# Altium schematic sheet esp32-wroom-32.SchDoc
size 355 x 241 mm; SheetNumber: 3; SheetTotal: 3
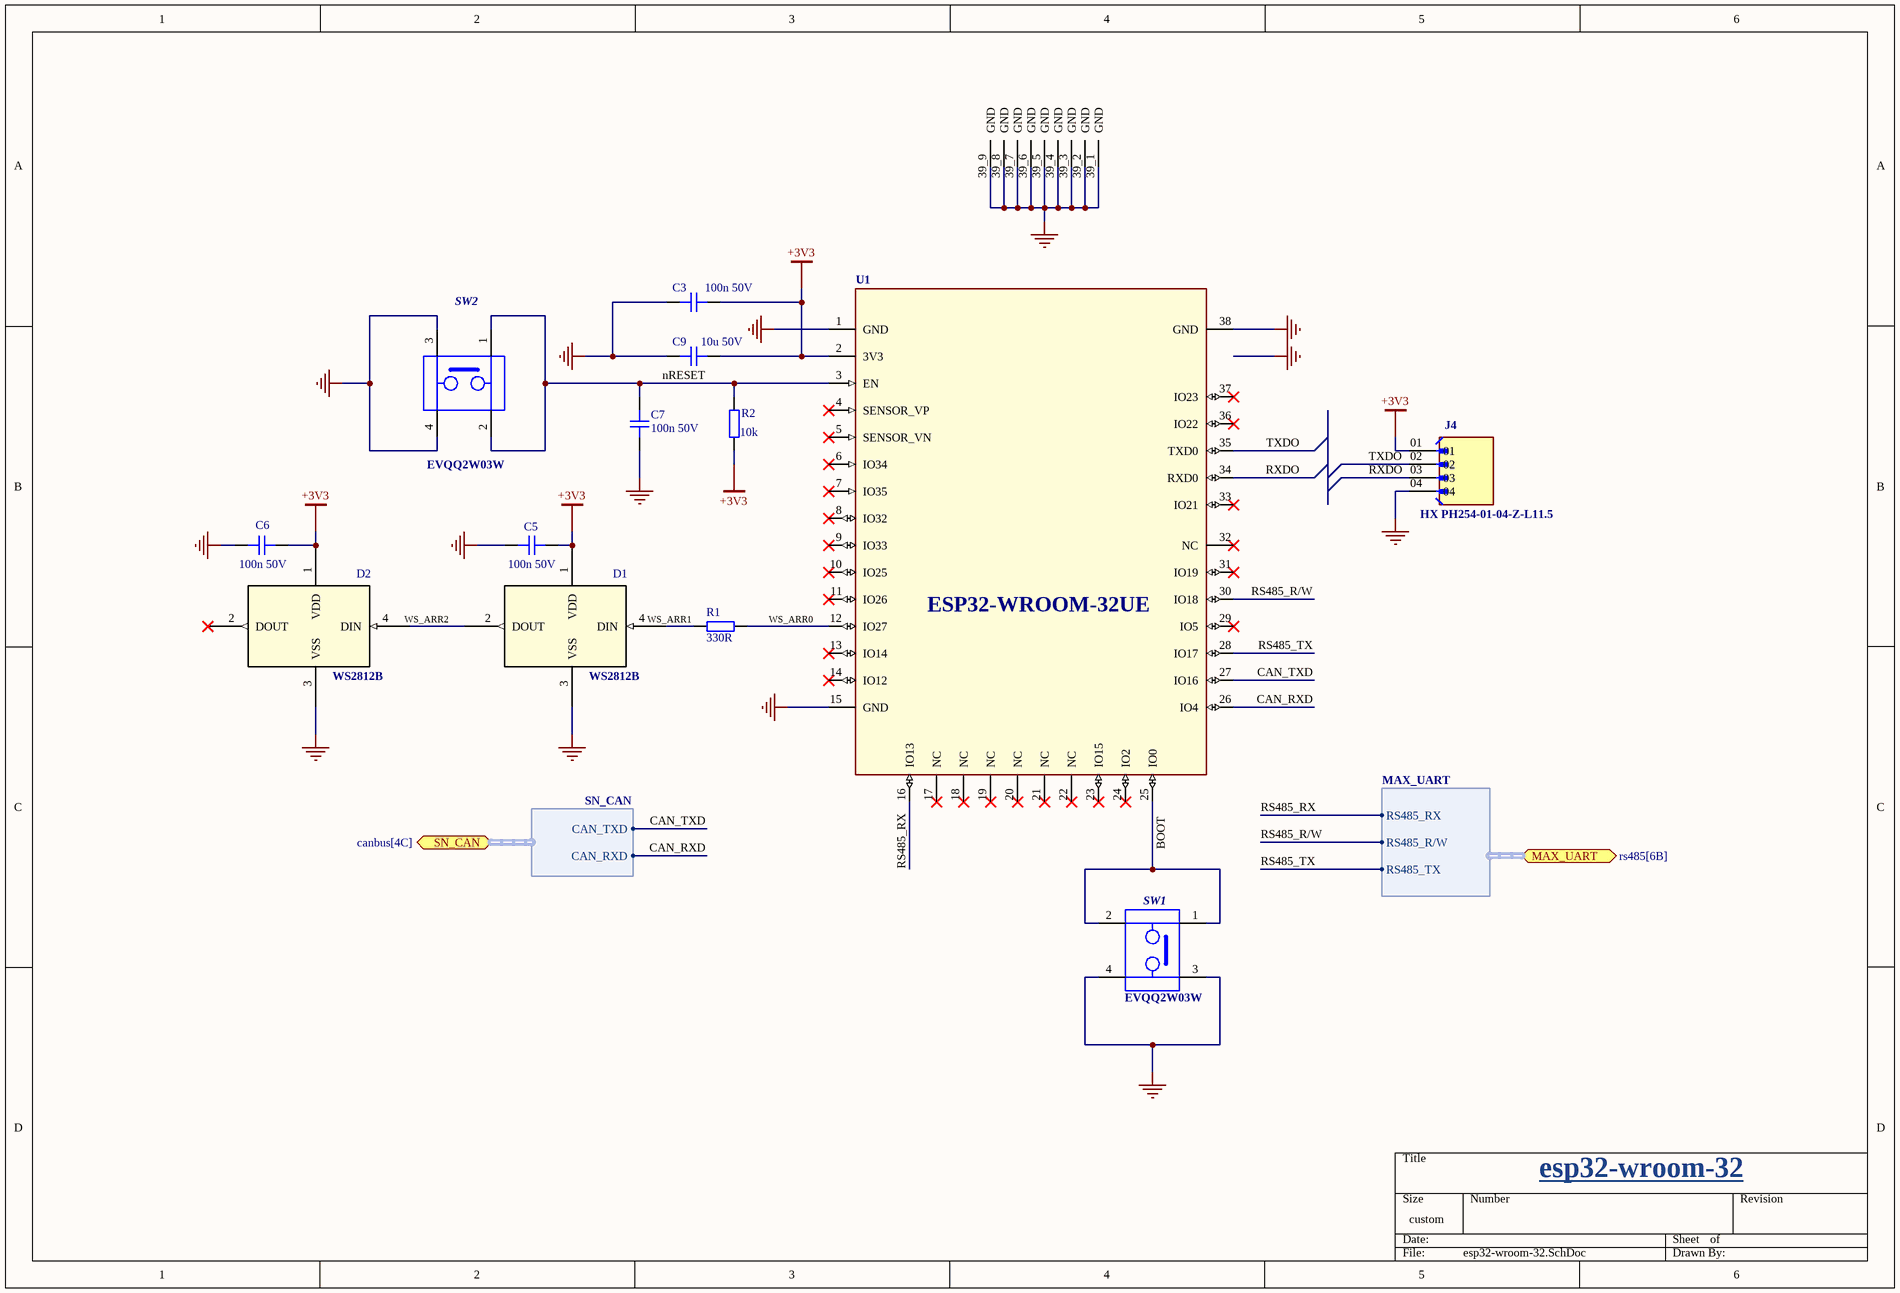
[diagram p0: esp32-wroom-32.SchDoc]

## Parts
C3  100n 50V  [CAP_0603]
C5  100n 50V  [CAP_0603]
C6  100n 50V  [CAP_0603]
C7  100n 50V  [CAP_0805]
C9  10u 50V  [CAP_0603]
D1  WS2812B  [WS2812B_WDS]
D2  WS2812B  [WS2812B_WDS]
J4  HX PH254-01-04-Z-L11.5  [SAMTEC_TSW-104-08-T-S-LL]
R1  330R  [RES_0805]
R2  10k  [RES_0805]
SW1  EVQQ2W03W  [EVQQ2W03W]
SW2  EVQQ2W03W  [EVQQ2W03W]
U1  ESP32-WROOM-32UE  [MODULE_ESP32-WROOM-32UE(M113EH6400UH3Q0)]

## Ports
MAX_UART (bidir, harness MAX_UART, see rs485[6B]), SN_CAN (bidir, harness SN_CAN, see canbus[4C])

## Harnesses
MAX_UART: RS485_RX, RS485_R/W, RS485_TX
SN_CAN: CAN_TXD, CAN_RXD

## Nets
+3V3: C3.2 C5.2 C6.2 C9.2 D1.1(VDD) D2.1(VDD) J4.01 R2.1 U1.2(3V3)
GND: C3.1 C5.1 C6.1 C7.1 C9.1 D1.3(VSS) D2.3(VSS) J4.04 SW1.3 SW1.4 SW2.3 SW2.4 U1.1(GND) U1.15(GND) U1.38(GND) U1.39_1(GND) U1.39_2(GND) U1.39_3(GND) U1.39_4(GND) U1.39_5(GND) U1.39_6(GND) U1.39_7(GND) U1.39_8(GND) U1.39_9(GND)
BOOT: SW1.1 SW1.2 U1.25(IO0)
CAN_RXD: U1.26(IO4) ; port SN_CAN.CAN_RXD
CAN_TXD: U1.27(IO16) ; port SN_CAN.CAN_TXD
nRESET: C7.2 R2.2 SW2.1 SW2.2 U1.3(EN)
RS485_R/W: U1.30(IO18) ; port MAX_UART.RS485_R/W
RS485_RX: U1.16(IO13) ; port MAX_UART.RS485_RX
RS485_TX: U1.28(IO17) ; port MAX_UART.RS485_TX
RXDO: J4.03 U1.34(RXD0)
TXDO: J4.02 U1.35(TXD0)
WS_ARR0: R1.1 U1.12(IO27)
WS_ARR1: D1.4(DIN) R1.2
WS_ARR2: D1.2(DOUT) D2.4(DIN)

Not connected (* = marked no-connect by the designer): D2 2(DOUT)*; U1 4(SENSOR_VP)* 5(SENSOR_VN)* 6(IO34)* 7(IO35)* 8(IO32)* 9(IO33)* 10(IO25)* 11(IO26)* 13(IO14)* 14(IO12)* 17(NC)* 18(NC)* 19(NC)* 20(NC)* 21(NC)* 22(NC)* 23(IO15)* 24(IO2)* 29(IO5)* 31(IO19)* 32(NC)* 33(IO21)* 36(IO22)* 37(IO23)*

## Notes on the sheet
- esp32-wroom-32

## Library data of the parts
C3 C5 C6 C9 = CAP_0603: Capacitor SMD 0603; Manufacturer: *; Manufacturer Part Number: *; Distributor Link: *; LCSC: *; Rating: *; Dielectric: *
C7 = CAP_0805: Capacitor SMD 0805; Manufacturer: *; Manufacturer Part Number: *; Distributor Link: *; LCSC: *; Rating: *; Dielectric: *
D1 D2 = WS2812B: Description; Manufacturer_Name: Worldsemi; Copyright: Copyright (C) 2026 Ultra Librarian. All rights reserved.; Manufacturer_Part_Number: WS2812B; RefDes: RefDes; Type: Type
J4 = 4PIN_TSW-104-08-T-S-LL: MF: Samtec; Availability: Unavailable; Value: *; Package: None; Price: None; MP: TSW-104-08-T-S-LL
R1 R2 = RES_0805: Resistor SMD 0805; Manufacturer: *; Manufacturer Part Number: *; Distributor Link: *; LCSC: *
SW1 SW2 = EVQQ2W03W: White Push Plate Tactile Switch, SPST-NO 20 mA 3.1mm; MF: Panasonic; Package: None; Check_prices: https://www.snapeda.com/parts/EVQQ2W03W/Panasonic/view-part/?ref=eda; SnapEDA_Link: https://www.snapeda.com/parts/EVQQ2W03W/Panasonic/view-part/?ref=snap; Price: None; Availability: In Stock; MP: EVQQ2W03W; Value: *
U1 = ESP32-WROOM-32UE(M113EH6400UH3Q0): Bluetooth, WiFi 802.11b/g/n, Bluetooth v4.2 +EDR, Class 1, 2 and 3 Transceiver Module 2.4GHz ~ 2.5GHz Antenna Not Included, U.FL Surface Mount; MF: Espressif Systems; Price: None; Check_prices: https://www.snapeda.com/parts/ESP32-WROOM-32UE(M113EH6400UH3Q0)/Espressif+Systems/view-part/?ref=eda; Value: *; Package: None; SnapEDA_Link: https://www.snapeda.com/parts/ESP32-WROOM-32UE(M113EH6400UH3Q0)/Espressif+Systems/view-part/?ref=snap; MP: ESP32-WROOM-32UE(M113EH6400UH3Q0); Availability: Not in stock